# EAGLE design V4.0 Embutida (EAGLE 9.6.2)
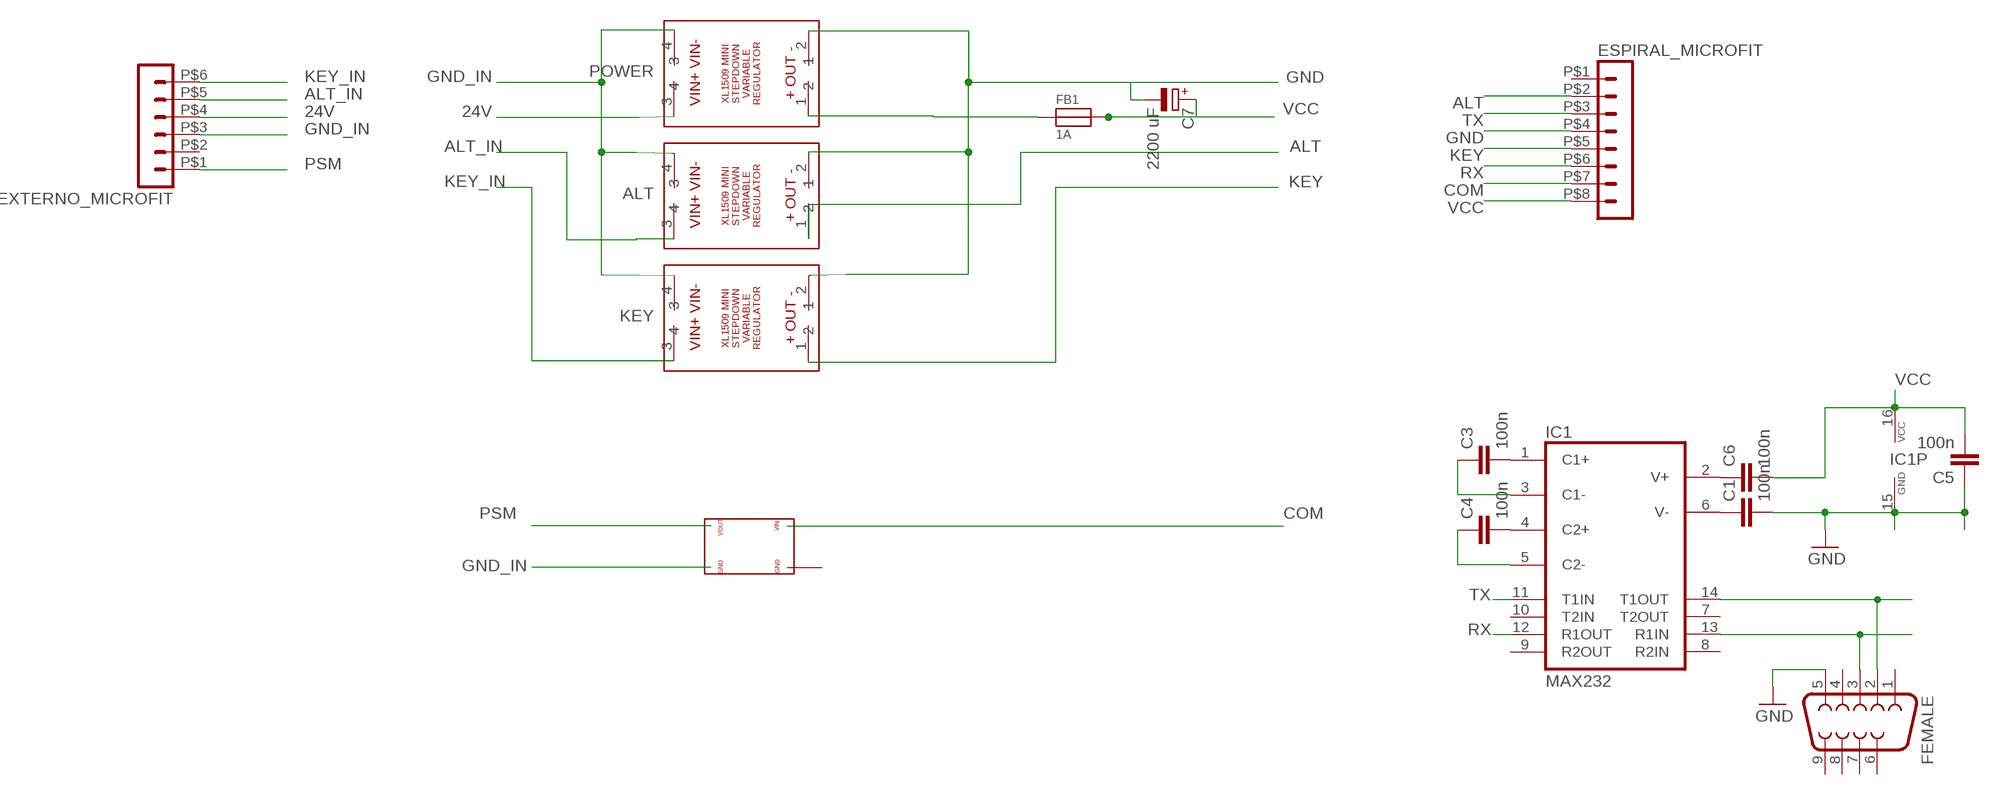
[diagram p0: schematic, sheet 1]

## Parts
ALT  XL1509WITH_SMDPADS&THROUGHHOLES  [XL1509]
C1  100n  C-EUC0805  [C0805]
C3  100n  C-EUC0805  [C0805]
C4  100n  C-EUC0805  [C0805]
C5  100n  C-EUC0805  [C0805]
C6  100n  C-EUC0805  [C0805]
C7  2200 uF  CPOL-EUD  [PANASONIC_D]
ESPIRAL_MICROFIT  HEADER_POS8_43045-0800  [43045-0800]
EXTERNO_MICROFIT  HEADER_POS6_43045-0600  [43045-0600]
FB1  1A  FERRITE0805  [0805]
FEMALE  F09H  [F09H]
IC1  MAX232  MAX232ECWES  [SO16]
KEY  XL1509WITH_SMDPADS&THROUGHHOLES  [XL1509]
POWER  XL1509WITH_SMDPADS&THROUGHHOLES  [XL1509]
U$1  STEP-UP  [STEP-UP]

## Nets
24V: EXTERNO_MICROFIT.P$4 POWER.3
ALT: ALT.1 ESPIRAL_MICROFIT.P$2
ALT_IN: ALT.3 EXTERNO_MICROFIT.P$5
COM: ESPIRAL_MICROFIT.P$7 U$1.VIN
GND: ALT.2 C1.2 C5.1 C7.- ESPIRAL_MICROFIT.P$4 FEMALE.5 IC1.15(GND) KEY.2 POWER.2
GND_IN: ALT.4 EXTERNO_MICROFIT.P$3 KEY.4 POWER.4 U$1.GND_OUT
KEY: ESPIRAL_MICROFIT.P$5 KEY.1
KEY_IN: EXTERNO_MICROFIT.P$6 KEY.3
N$3: FB1.1 POWER.1
N$11: C3.2 IC1.1(C1+)
N$12: C4.2 IC1.4(C2+)
N$13: C3.1 IC1.3(C1-)
N$17: C4.1 IC1.5(C2-)
N$18: C6.1 IC1.2(V+)
N$19: C1.1 IC1.6(V-)
N$20: FEMALE.2 IC1.14(T1OUT)
N$30: FEMALE.3 IC1.13(R1IN)
PSM: EXTERNO_MICROFIT.P$1 U$1.VOUT(OUT)
RX: ESPIRAL_MICROFIT.P$6 IC1.12(R1OUT)
TX: ESPIRAL_MICROFIT.P$3 IC1.11(T1IN)
VCC: C5.2 C6.2 C7.+ ESPIRAL_MICROFIT.P$8 FB1.2 IC1.16(VCC)
Unconnected: ESPIRAL_MICROFIT.P$1 EXTERNO_MICROFIT.P$2 FEMALE.1 FEMALE.4 FEMALE.6 FEMALE.7 FEMALE.8 FEMALE.9 IC1.7(T2OUT) IC1.8(R2IN) IC1.9(R2OUT) IC1.10(T2IN) U$1.GND_IN

## Library data of the parts
ALT KEY POWER = XL1509 MINI STEPDOWN BUCK MODULE:XL1509: XL1509 Mini Stepdown Buck Module
C1 C3-C6 = rcl@1:C-EU: CAPACITOR, European symbol; MPN: C0805C104K8RACAUTO
C7 = rcl:CPOL-EU: POLARIZED CAPACITOR, European symbol; SPICEPREFIX: C
ESPIRAL_MICROFIT = con-molex-micro-fit-3_0 (1):HEADER_POS8_?: Molex - Micro-Fit 3.0 Series connector, 3.00mm (0.118") pitch header, 8 positions.
EXTERNO_MICROFIT = con-molex-micro-fit-3_0 (1):HEADER_POS6_?: Molex - Micro-Fit 3.0 Series connector, 3.00mm (0.118") pitch header, 6 positions.
FB1 = microbuilder:FERRITE: Ferrite Bead 0603 MMZ1608B121C - 120 Ohm, 600mA Ferrite Chip - Digikey: 445-2164-1-ND BK1608HW121-T - 120 Ohm, 600mA Ferrite Chip - Digikey: 587-1876-2-ND 0805 HZ0805B272R-10 - 2.7K Ohm @ 100MHz, 200mA 0.8 Ohm DC Resistance - Digikey: 240-2504-1-ND (see also Murata BLM21BD272SN1L); MPN: BLM21AG121SN1D
FEMALE = con-subd:F09: SUB-D; OC_FARNELL: unknown; OC_NEWARK: unknown
IC1 = maxim-6b:MAX232ECWE: RS232 TRANSEIVER
U$1 = Step Up:STEP-UP

## Module LDR
Ports: 

### Library data of the parts

## Net classes
1 New Class: width 0.5 mm, drill 1 mm

## Board
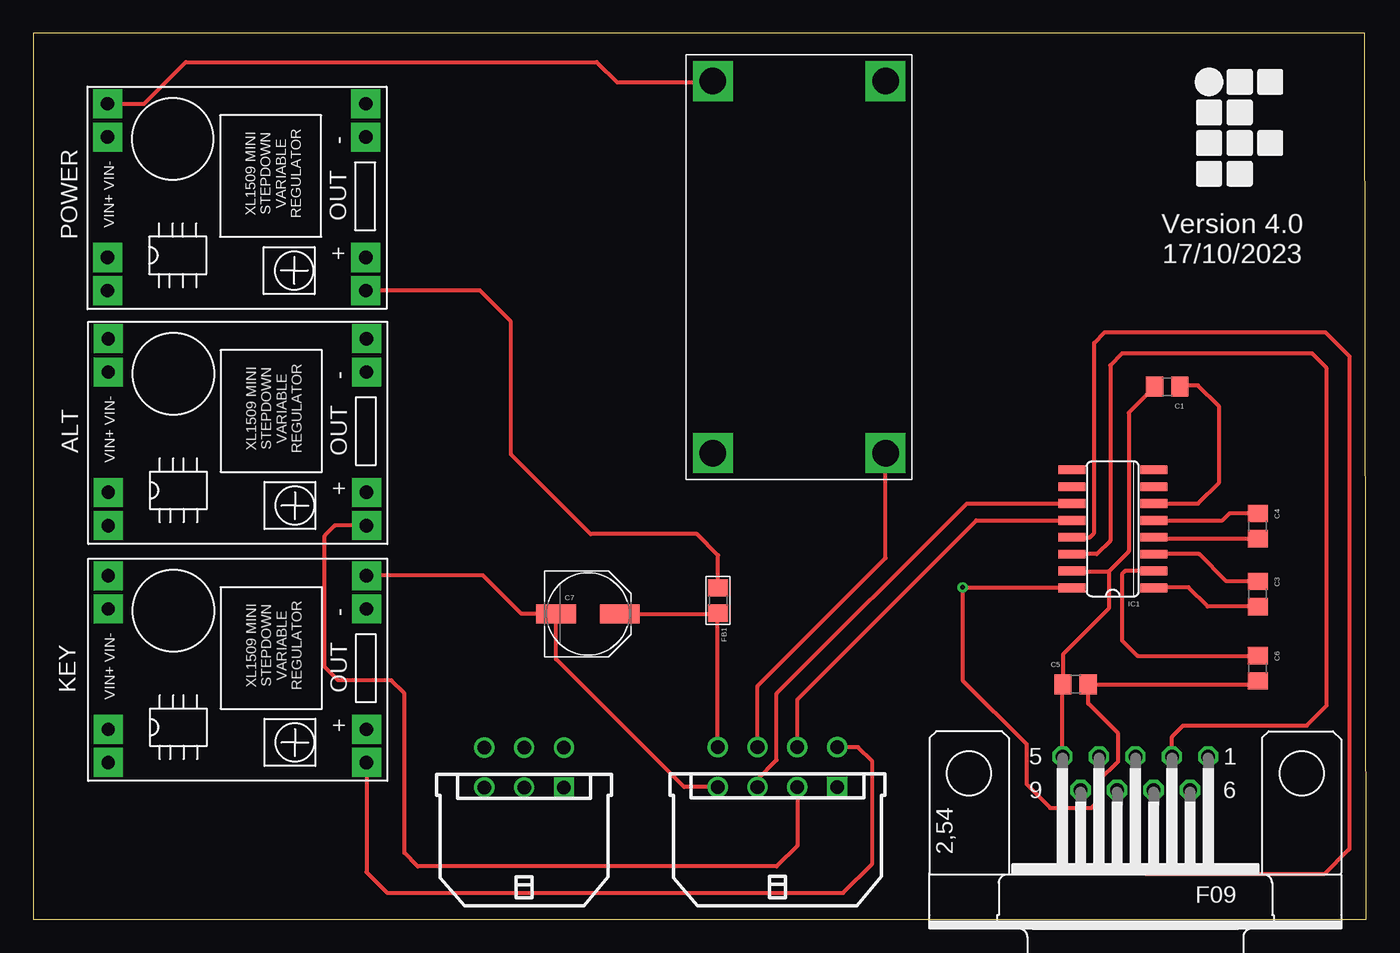
[diagram p1: board, top side]
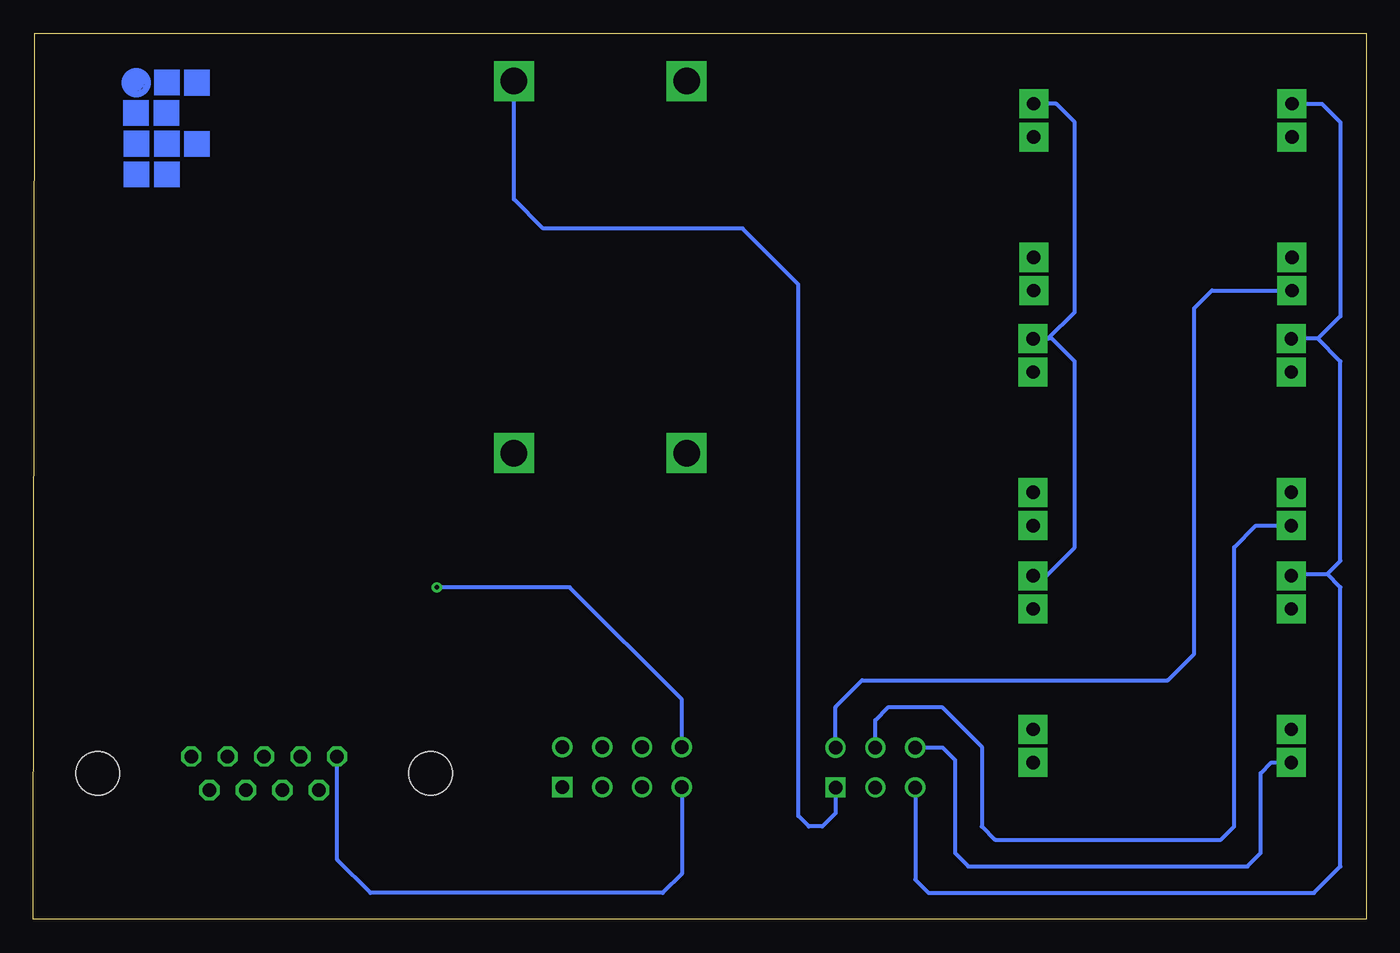
[diagram p2: board, bottom side, seen from below]

Size 100.32 x 66.7 mm. Coordinates in mm from the lower left corner, seen from the top.
Outline: 0,0 100.32,0 100.2,66.7 0,66.7 0,0
Copper layers (1*16): Top 0.035mm / dielectric 1.5mm / Bottom 0.035mm
Design rules "default *": minimum track width 6mil, minimum drill 0.35mm, track to track 6mil, track to pad 6mil, pad to pad 6mil, via to via 6mil, smd to smd 6mil, copper to edge 40mil, drill to drill 6mil, minimum pad ring 10mil, minimum via ring 8mil, stop-mask expansion 4mil, vias tented up to drill 0mil, thermal gap 10mil

### Footprints (pad centres in the part's own frame; a part is rotated, then mirrored left to right if it is on the bottom)
XL1509 = drill 1 pad 2.184 square: 1 -7.1,-8.431; 2 6.96,-8.431; 3 -7.1,11; 4 6.96,11; 5 -4.6,-8.431; 6 4.46,-8.431; 7 -4.6,11; 8 4.46,11
C0805 = smd 1.3 x 1.5: 1 -0.95,0; 2 0.95,0
PANASONIC_D = smd 3 x 1.4: + 2.4,0; - -2.4,0
43045-0800 = drill 1.02 square: P$1 4.5,4.32 | drill 1.02: P$2 1.5,4.32; P$3 -1.5,4.32; P$4 -4.5,4.32; P$5 4.5,7.32; P$6 1.5,7.32; P$7 -1.5,7.32; P$8 -4.5,7.32
43045-0600 = drill 1.02 square: P$1 3,4.32 | drill 1.02: P$2 0,4.32; P$3 -3,4.32; P$4 3,7.32; P$5 0,7.32; P$6 -3,7.32
0805 = smd 1.3 x 1.5: 1 -0.95,0; 2 0.95,0
F09H = drill 1.016 octagon: 1 -5.486,-1.27; 2 -2.743,-1.27; 3 0,-1.27; 4 2.743,-1.27; 5 5.486,-1.27; 6 -4.115,1.27; 7 -1.372,1.27; 8 1.372,1.27; 9 4.115,1.27 | hole 3.302: -12.522,0; 12.522,0
SO16 = smd 0.66 x 2.032: 1 -4.445,-3.073; 2 -3.175,-3.073; 3 -1.905,-3.073; 4 -0.635,-3.073; 5 0.635,-3.073; 6 1.905,-3.073; 7 3.175,-3.073; 8 4.445,-3.073; 9 4.445,3.073; 10 3.175,3.073; 11 1.905,3.073; 12 0.635,3.073; 13 -0.635,3.073; 14 -1.905,3.073; 15 -3.175,3.073; 16 -4.445,3.073
STEP-UP = drill 2 square: GND_IN -15,2; GND_OUT -15,30; VIN -2,2; VOUT -2,30

### Placement (x,y rotation side)
ALT  16.65,36.74 90 top
C1  85.34,40.09 180 top
C3  92.14,24.49 270 top
C4  92.14,29.59 270 top
C5  78.44,17.69 0 top
C6  92.14,18.89 270 top
C7  41.74,22.99 0 top
ESPIRAL_MICROFIT  56.01,5.64 0 top
EXTERNO_MICROFIT  36.94,5.62 0 top
FB1  51.54,23.99 270 top
FEMALE  82.94,10.99 180 top
IC1  81.24,29.39 90 top
KEY  16.65,18.91 90 top
POWER  16.59,54.43 90 top
U$1  66.14,33.09 0 top

### Tracks (layer width: path | path; a pad name or v marks a point on that pad's centre or on a via)
24V
  Bottom 0.305: POWER.3 11.61,47.33 12.94,45.99 12.94,19.99 14.94,17.99 37.94,17.99 39.94,15.99 EXTERNO_MICROFIT.P$4
ALT
  Top 0.305: ESPIRAL_MICROFIT.P$2 57.51,5.56 55.94,3.99 28.94,3.99 27.94,4.99 27.94,16.99 26.94,17.99 22.94,17.99 21.94,18.99 21.94,28.89 22.69,29.64 ALT.1
ALT_IN
  Bottom 0.305: EXTERNO_MICROFIT.P$5 36.94,14.99 35.94,15.99 31.94,15.99 28.94,12.99 28.94,6.99 27.94,5.99 10.94,5.99 9.94,6.99 9.94,27.99 8.3,29.64 ALT.3
COM
  Top 0.305: ESPIRAL_MICROFIT.P$7 54.51,17.56 64.14,27.19 U$1.VIN
GND
  Top 0.305: 25.2,25.99 KEY.2 25.1,25.89 33.84,25.89 36.74,22.99 C7.- 39.34,19.59 48.98,9.96 ESPIRAL_MICROFIT.P$4 | C1.2 82.44,38.14 82.44,27.69 80.94,26.19 | IC1.15 78.2,26.19 80.94,26.19 | 80.94,26.19 80.94,23.39 77.49,19.94 77.49,17.99 | 77.49,17.99 C5.1 | FEMALE.5 77.46,17.96 77.49,17.99
  Bottom 0.305: KEY.2 24.07,25.87 21.94,27.99 21.94,41.99 23.65,43.7 23.94,43.7 | 23.94,43.7 ALT.2 | 23.94,43.7 21.94,45.7 21.94,59.99 23.34,61.39 POWER.2 | ESPIRAL_MICROFIT.P$4 51.51,3.43 52.94,1.99 74.94,1.99 77.44,4.49 77.44,12.25 FEMALE.5
GND_IN
  Top 0.305: 5.52,25.99 KEY.4 | 5.35,43.99 ALT.4 | POWER.4 8.34,61.39 11.48,64.53 42.41,64.53 43.94,62.99 51.04,62.99 U$1.GND_OUT
  Bottom 0.305: EXTERNO_MICROFIT.P$3 33.94,2.99 32.94,1.99 3.94,1.99 1.94,3.99 1.94,24.99 2.94,25.99 | 2.94,25.99 5.52,25.99 KEY.4 | 2.94,25.99 1.94,26.99 1.94,41.99 3.65,43.7 | 3.65,43.7 ALT.4 | POWER.4 3.34,61.39 1.94,59.99 1.94,45.41 3.65,43.7
KEY
  Top 0.305: KEY.1 25.08,3.56 26.64,1.99 60.94,1.99 63.14,4.19 63.14,11.89 62.08,12.96 ESPIRAL_MICROFIT.P$5
KEY_IN
  Bottom 0.305: EXTERNO_MICROFIT.P$6 31.89,12.94 30.94,11.99 30.94,4.99 29.94,3.99 8.94,3.99 7.94,4.99 7.94,10.99 7.13,11.81 KEY.3
N$3
  Top 0.305: FB1.1 51.54,27.39 49.94,28.99 41.94,28.99 35.94,34.99 35.94,44.99 33.61,47.33 POWER.1
N$11
  Top 0.305: C3.2 88.39,23.54 86.94,24.99 84.36,24.99 IC1.1
N$12
  Top 0.305: C4.2 84.43,28.64 IC1.4
N$13
  Top 0.305: C3.1 89.79,25.44 87.75,27.49 IC1.3
N$17
  Top 0.305: C4.1 89.99,30.54 89.44,29.99 84.35,29.99 IC1.5
N$18
  Top 0.305: IC1.2 82.17,26.22 81.94,25.99 81.94,20.99 83.09,19.84 C6.1
N$19
  Top 0.305: IC1.6 87.65,31.3 89.24,32.89 89.24,38.59 87.64,40.19 86.39,40.19 C1.1
N$20
  Top 0.305: FEMALE.2 85.69,13.74 86.54,14.59 95.84,14.59 97.34,16.09 97.34,41.49 96.24,42.59 81.94,42.59 81.04,41.69 81.04,28.49 80.04,27.49 IC1.14
N$30
  Top 0.305: IC1.13 79.51,28.76 79.84,29.09 79.84,43.39 80.64,44.19 97.24,44.19 99.07,42.36 99.07,5.33 99.03,5.28 98.97,5.23 97.14,3.39 83.74,3.39 82.94,4.19 FEMALE.3
PSM
  Bottom 0.305: EXTERNO_MICROFIT.P$1 39.94,7.99 40.94,6.99 41.94,6.99 42.74,7.79 42.74,47.79 46.94,51.99 61.94,51.99 64.14,54.19 U$1.VOUT
RX
  Top 0.305: ESPIRAL_MICROFIT.P$6 57.51,16.56 70.98,30.03 IC1.12
TX
  Top 0.305: ESPIRAL_MICROFIT.P$3 54.51,10.56 55.94,11.99 55.94,16.99 70.25,31.3 IC1.11
VCC  (via drill 0.35)
  Top 0.305: ESPIRAL_MICROFIT.P$8 51.51,22.89 | 51.51,22.89 51.51,23.01 | 51.51,23.01 FB1.2 | 51.47,23.04 51.51,23.01 | IC1.16 78.13,24.99 v69.94,24.99 69.94,17.99 74.74,13.19 74.74,10.19 76.54,8.39 79.64,8.39 80.24,8.99 80.24,10.49 81.64,11.89 81.64,13.99 79.39,16.24 C5.2 | 91.69,17.49 91.89,17.69 | C5.2 91.89,17.69 | 91.89,17.69 C6.2 | 79.44,17.64 C5.2 | C7.+ 51.41,22.99 51.51,22.89
  Bottom 0.305: ESPIRAL_MICROFIT.P$8 51.51,16.56 59.94,24.99 v69.94,24.99
(copper drawn outside any net)
  shapes: Bottom area x9, Bottom circle x3

### Text on the board
tNames: Version 4.0 / 17/10/2023